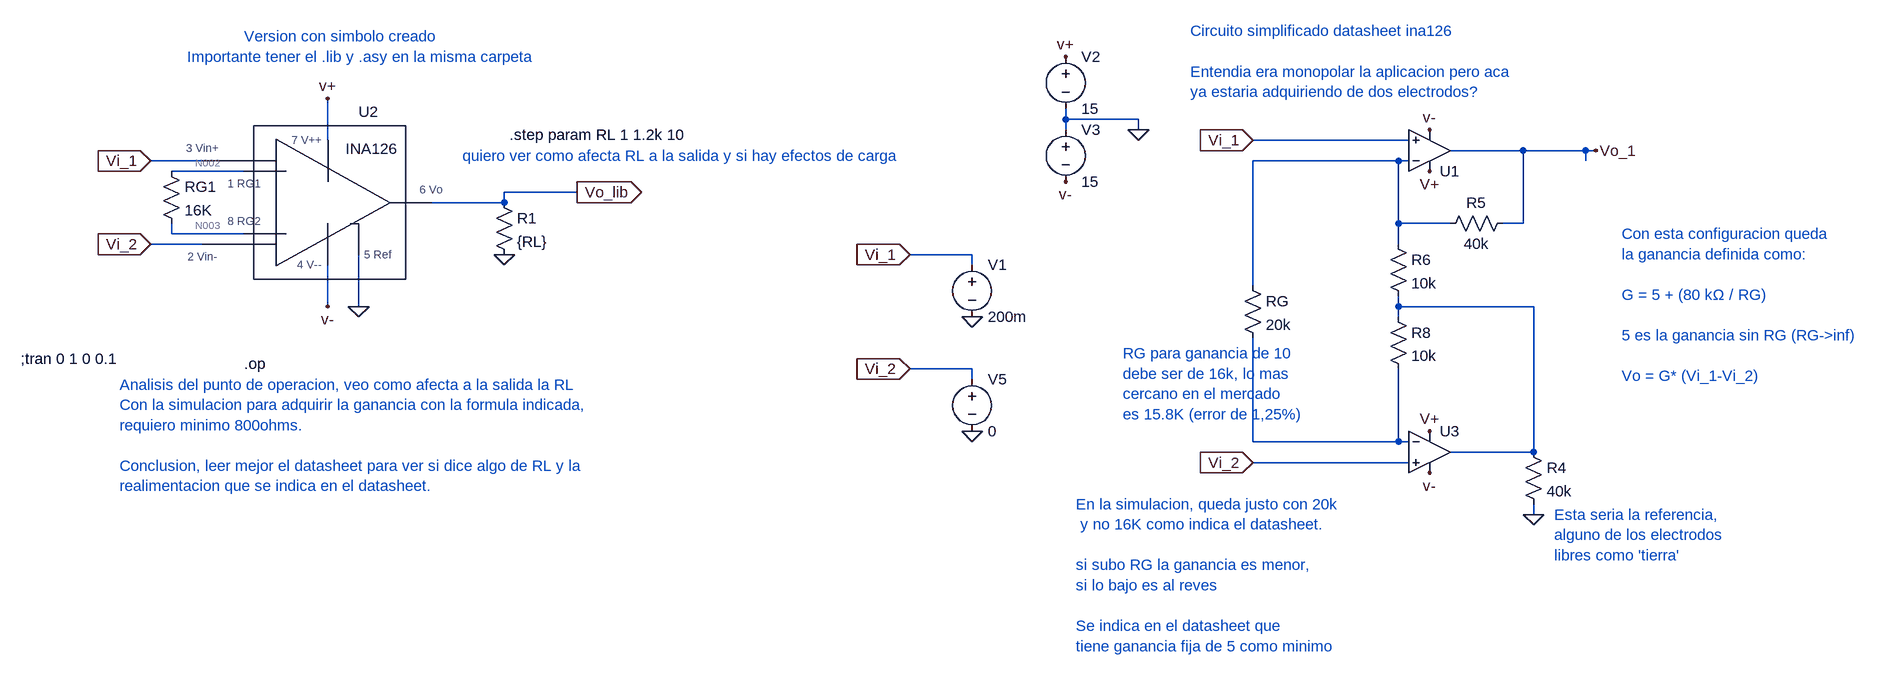
[diagram p0: schematic PREAMP_INA2126.asc]
PREAMP_INA2126.asc, the LTspice schematic file:
Version 4
SHEET 1 1592 1092
WIRE 208 288 208 272
WIRE 320 288 208 288
WIRE 208 304 208 288
WIRE 320 304 320 288
WIRE -928 320 -928 256
WIRE 736 320 496 320
WIRE 912 336 800 336
WIRE 1008 336 912 336
WIRE 1024 336 1008 336
WIRE -1120 352 -1200 352
WIRE 720 352 496 352
WIRE 736 352 720 352
WIRE 1008 352 1008 336
WIRE -1056 368 -1168 368
WIRE -544 400 -656 400
WIRE -656 416 -656 400
WIRE -656 416 -768 416
WIRE 720 448 720 352
WIRE 800 448 720 448
WIRE 912 448 912 336
WIRE 912 448 880 448
WIRE -1168 464 -1168 448
WIRE -1056 464 -1168 464
WIRE -1120 480 -1200 480
WIRE 720 480 720 448
WIRE 64 496 -32 496
WIRE 64 512 64 496
WIRE 496 544 496 352
WIRE -928 576 -928 512
WIRE -880 576 -880 496
WIRE 720 576 720 560
WIRE 928 576 720 576
WIRE 720 592 720 576
WIRE 64 672 -32 672
WIRE 64 688 64 672
WIRE 496 784 496 624
WIRE 720 784 720 672
WIRE 720 784 496 784
WIRE 736 784 720 784
WIRE 928 800 928 576
WIRE 928 800 800 800
WIRE 736 816 496 816
WIRE 928 896 928 880
FLAG 320 304 0
FLAG 208 192 v+
FLAG 928 896 0
FLAG 768 368 V+
FLAG 768 768 V+
FLAG 208 384 v-
FLAG 496 320 Vi_1
IOPIN 496 320 In
FLAG -32 496 Vi_1
IOPIN -32 496 In
FLAG 496 816 Vi_2
IOPIN 496 816 In
FLAG -32 672 Vi_2
IOPIN -32 672 In
FLAG 768 304 v-
FLAG 768 832 v-
FLAG 1024 336 Vo_1
FLAG 64 592 0
FLAG 64 768 0
FLAG -1200 480 Vi_2
IOPIN -1200 480 In
FLAG -1200 352 Vi_1
IOPIN -1200 352 In
FLAG -928 256 v+
FLAG -928 576 v-
FLAG -880 576 0
FLAG -656 496 0
FLAG -544 400 Vo_lib
IOPIN -544 400 Out
SYMBOL voltage 208 176 R0
SYMATTR InstName V2
SYMATTR Value 15
SYMBOL voltage 208 288 R0
WINDOW 123 0 0 Left 0
WINDOW 39 0 0 Left 0
SYMATTR InstName V3
SYMATTR Value 15
SYMBOL OpAmps\\UniversalOpAmp1 768 336 M180
SYMATTR InstName U1
SYMBOL OpAmps\\UniversalOpAmp1 768 800 R0
SYMATTR InstName U3
SYMBOL res 784 464 R270
WINDOW 0 32 56 VTop 2
WINDOW 3 0 56 VBottom 2
SYMATTR InstName R5
SYMATTR Value 40k
SYMBOL res 704 464 R0
SYMATTR InstName R6
SYMATTR Value 10k
SYMBOL res 704 576 R0
SYMATTR InstName R8
SYMATTR Value 10k
SYMBOL res 480 528 R0
SYMATTR InstName RG
SYMATTR Value 20k
SYMBOL res 912 784 R0
SYMATTR InstName R4
SYMATTR Value 40k
SYMBOL voltage 64 496 R0
WINDOW 123 0 0 Left 0
WINDOW 39 0 0 Left 0
SYMATTR InstName V1
SYMATTR Value 200m
SYMBOL voltage 64 672 R0
WINDOW 123 0 0 Left 0
WINDOW 39 0 0 Left 0
SYMATTR InstName V5
SYMATTR Value 0
SYMBOL INA126 -960 416 R0
WINDOW 0 95 -124 Bottom 2
WINDOW 3 100 -98 Top 2
SYMATTR InstName U2
SYMBOL res -1184 352 R0
SYMATTR InstName RG1
SYMATTR Value 16K
SYMBOL res -672 400 R0
SYMATTR InstName R1
SYMATTR Value {RL}
TEXT 400 152 Left 2 ;Circuito simplificado datasheet ina126 \n \nEntendia era monopolar la aplicacion pero aca \nya estaria adquiriendo de dos electrodos?
TEXT 960 896 Left 2 ;Esta seria la referencia, \nalguno de los electrodos \nlibres como 'tierra'
TEXT 296 648 Left 2 ;RG para ganancia de 10\ndebe ser de 16k, lo mas \ncercano en el mercado\nes 15.8K (error de 1,25%)
TEXT 1064 464 Left 2 ;Con esta configuracion queda \nla ganancia definida como:\n \nG = 5 + (80 kΩ / RG)\n \n5 es la ganancia sin RG (RG->inf)\n \nVo = G* (Vi_1-Vi_2)
TEXT -1400 656 Left 2 !;tran 0 1 0 0.1
TEXT 224 880 Left 2 ;En la simulacion, queda justo con 20k\n y no 16K como indica el datasheet.\n \nsi subo RG la ganancia es menor,\nsi lo bajo es al reves\n \nSe indica en el datasheet que \ntiene ganancia fija de 5 como minimo
TEXT -1056 160 Left 2 ;Version con simbolo creado
TEXT -1144 192 Left 2 ;Importante tener el .lib y .asy en la misma carpeta
TEXT -648 312 Left 2 !.step param RL 1 1.2k 10
TEXT -720 344 Left 2 ;quiero ver como afecta RL a la salida y si hay efectos de carga
TEXT -1056 664 Left 2 !.op
TEXT -1248 696 Left 2 ;Analisis del punto de operacion, veo como afecta a la salida la RL\nCon la simulacion para adquirir la ganancia con la formula indicada,\nrequiero minimo 800ohms. \n \nConclusion, leer mejor el datasheet para ver si dice algo de RL y la \nrealimentacion que se indica en el datasheet.

The netlist it stands for:
* PREAMP_INA2126.asc
V2 v+ 0 15
V3 0 v- 15
XU1 Vi_1 N001 v+ v- Vo_1 level1 Avol=1Meg GBW=10Meg Vos=0 En=0 Enk=0 In=0 Ink=0 Rin=500Meg  ; pins In+ In- V+ V- OUT
XU3 Vi_2 N005 v+ v- N004 level1 Avol=1Meg GBW=10Meg Vos=0 En=0 Enk=0 In=0 Ink=0 Rin=500Meg  ; pins In+ In- V+ V- OUT
R5 N001 Vo_1 40k
R6 N001 N004 10k
R8 N004 N005 10k
RG N001 N005 20k
R4 N004 0 40k
V1 Vi_1 0 200m
V5 Vi_2 0 0
XU2 N002 Vi_2 Vi_1 v- 0 Vo_lib v+ N003 INA126  ; pins 1_RG1 2_Vin- 3_Vin+ 4_V-- 5_Ref 6_Vo 7_V++ 8_RG2
RG1 N002 N003 16K
R1 Vo_lib 0 {RL}
* Circuito simplificado datasheet ina126
* Entendia era monopolar la aplicacion pero aca
* ya estaria adquiriendo de dos electrodos?
* Esta seria la referencia,
* alguno de los electrodos
* libres como 'tierra'
* RG para ganancia de 10
* debe ser de 16k, lo mas
* cercano en el mercado
* es 15.8K (error de 1,25%)
* Con esta configuracion queda
* la ganancia definida como:
* G = 5 + (80 kΩ / RG)
* 5 es la ganancia sin RG (RG->inf)
* Vo = G* (Vi_1-Vi_2)
;tran 0 1 0 0.1
* En la simulacion, queda justo con 20k
*  y no 16K como indica el datasheet.
* si subo RG la ganancia es menor,
* si lo bajo es al reves
* Se indica en el datasheet que
* tiene ganancia fija de 5 como minimo
* Version con simbolo creado
* Importante tener el .lib y .asy en la misma carpeta
.step param RL 1 1.2k 10
* quiero ver como afecta RL a la salida y si hay efectos de carga
.op
* Analisis del punto de operacion, veo como afecta a la salida la RL
* Con la simulacion para adquirir la ganancia con la formula indicada,
* requiero minimo 800ohms.
* Conclusion, leer mejor el datasheet para ver si dice algo de RL y la
* realimentacion que se indica en el datasheet.
.lib UniversalOpAmp1.lib
.lib C:\Users\aguse\OneDrive\Escritorio\Fiuba\2025\TPP\0.1 PRELIMINAR\Simulaciones\Preamplificador\INA126.LIB
.backanno
.end

* Results of the author's LTspice run, read from the files saved beside the schematic
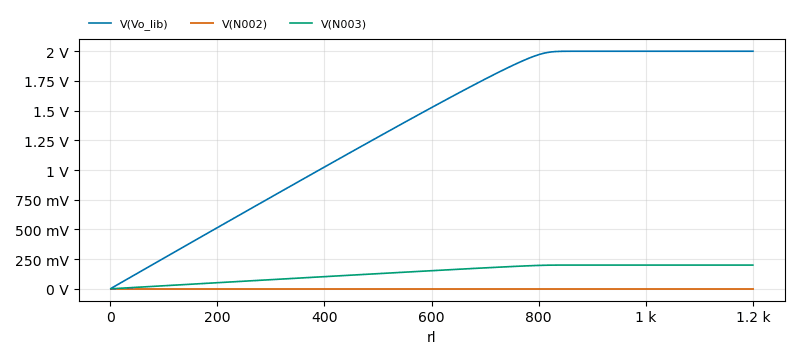
[diagram p1: Operating Point of PREAMP_INA2126.asc, plotted from the saved traces]
* Operating Point, 1 run:
*   V(Vo_lib): 2.588 mV at rl=1 , 2 V at rl=1.2 k, min 2.588 mV, max 2 V
*   V(N002): -5.77 µV at rl=1 , -4.482 µV at rl=1.2 k, min -5.77 µV, max -4.482 µV
*   V(N003): 332.7 µV at rl=1 , 200 mV at rl=1.2 k, min 332.7 µV, max 200 mV
* From the log:
*   Semiconductor Device Operating Points:
*                           --- Diodes ---
*   Name:   d:u2:1:c    d:u2:1:e    d:u2:1:lp   d:u2:1:ln   d:u2:1:p
*   Model:   u2:1:dx     u2:1:dx     u2:1:dx     u2:1:dx     u2:1:dx
*   Id:     -1.40e-11   -1.40e-11   -2.00e-12   -2.00e-12   -3.00e-11
*   Vd:     -1.40e+01   -1.40e+01   -2.00e+00   -2.00e+00   -3.00e+01
*   Req:     1.00e+12    1.00e+12    1.00e+12    1.00e+12    1.00e+12
*   CAP:     0.00e+00    0.00e+00    0.00e+00    0.00e+00    0.00e+00
*   Name:   d:u2:2:c    d:u2:2:e    d:u2:2:lp   d:u2:2:ln   d:u2:2:p
*   Model:   u2:2:dx     u2:2:dx     u2:2:dx     u2:2:dx     u2:2:dx
*   Id:     -1.40e-11   -1.40e-11    6.04e-06   -4.59e-12   -3.00e-11
*   Vd:     -1.40e+01   -1.40e+01    5.88e-01   -4.59e+00   -3.00e+01
*   Req:     1.00e+12    1.00e+12    4.29e+03    1.00e+12    1.00e+12
*   CAP:     0.00e+00    0.00e+00    0.00e+00    0.00e+00    0.00e+00
*                           --- Bipolar Transistors ---
*   Name:    q:u2:1:1    q:u2:1:2    q:u2:2:1    q:u2:2:2
*   Model:    u2:1:qx     u2:1:qx     u2:2:qx     u2:2:qx
*   Ib:      -1.99e-08   -1.99e-08   -3.98e-08   -1.32e-11
*   Ic:      -2.99e-06   -2.99e-06   -5.98e-06   -4.22e-09
*   Vbe:     -5.70e-01   -5.70e-01   -5.88e-01   -4.00e-01
*   Vbc:      1.50e+01    1.50e+01    1.49e+01    1.52e+01
*   Vce:     -1.55e+01   -1.55e+01   -1.55e+01   -1.56e+01
*   BetaDC:   1.50e+02    1.50e+02    1.50e+02    3.19e+02
*   Gm:       1.16e-04    1.16e-04    2.31e-04    1.62e-07
*   Rpi:      1.30e+06    1.30e+06    6.49e+05    9.22e+08
*   Rx:       0.00e+00    0.00e+00    0.00e+00    0.00e+00
*   Ro:       0.00e+00    0.00e+00    0.00e+00    0.00e+00
*   Cbe:      0.00e+00    0.00e+00    0.00e+00    0.00e+00
*   Cbc:      0.00e+00    0.00e+00    0.00e+00    0.00e+00
*   Cjs:      0.00e+00    0.00e+00    0.00e+00    0.00e+00
*   BetaAC:   1.50e+02    1.50e+02    1.50e+02    1.50e+02
*   Cbx:      0.00e+00    0.00e+00    0.00e+00    0.00e+00
*   Ft:       0.00e+00    0.00e+00    0.00e+00    0.00e+00